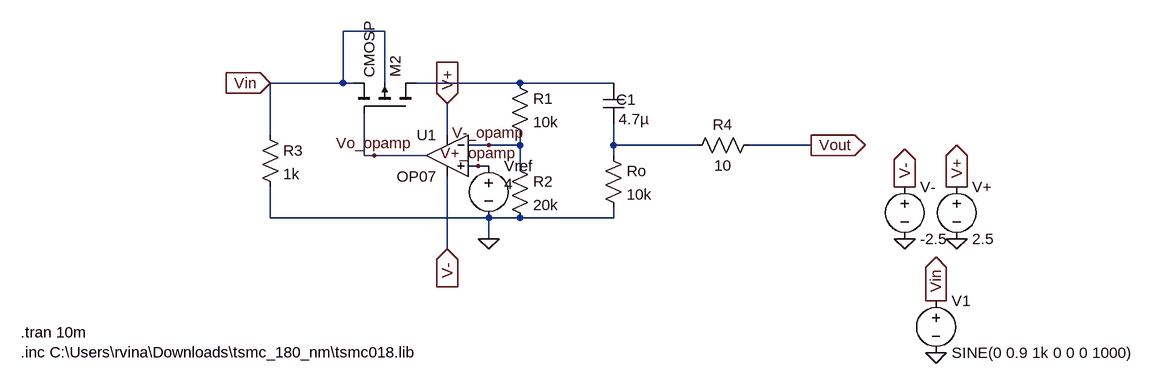
[diagram p0: schematic LDO.asc]
LDO.asc, the LTspice schematic file:
Version 4
SHEET 1 1232 680
WIRE 80 -16 16 -16
WIRE 16 64 16 -16
WIRE 16 64 -96 64
WIRE 32 64 16 64
WIRE 80 64 80 -16
WIRE 288 64 128 64
WIRE 432 64 288 64
WIRE -96 144 -96 64
WIRE 176 144 176 96
WIRE 240 160 208 160
WIRE 288 160 288 144
WIRE 288 160 240 160
WIRE 432 160 432 128
WIRE 560 160 432 160
WIRE 736 160 640 160
WIRE 48 176 48 112
WIRE 64 176 48 176
WIRE 144 176 64 176
WIRE 432 176 432 160
WIRE 224 192 208 192
WIRE 240 192 224 192
WIRE 288 192 288 160
WIRE -96 272 -96 224
WIRE 240 272 -96 272
WIRE 288 272 240 272
WIRE 432 272 432 256
WIRE 432 272 288 272
WIRE 240 304 240 272
WIRE 176 320 176 208
FLAG 240 304 0
FLAG 736 160 Vout
IOPIN 736 160 Out
FLAG 176 96 V+
IOPIN 176 96 In
FLAG 176 320 V-
IOPIN 176 320 In
FLAG 880 304 0
FLAG 960 304 0
FLAG 880 224 V-
IOPIN 880 224 Out
FLAG 960 224 V+
IOPIN 960 224 Out
FLAG 928 480 0
FLAG 928 400 Vin
IOPIN 928 400 Out
FLAG -96 64 Vin
IOPIN -96 64 In
FLAG 240 160 V-_opamp
FLAG 224 192 V+_opamp
FLAG 64 176 Vo_opamp
SYMBOL res 272 48 R0
SYMATTR InstName R1
SYMATTR Value 10k
SYMBOL res 272 176 R0
SYMATTR InstName R2
SYMATTR Value 20k
SYMBOL voltage 240 176 R0
WINDOW 123 0 0 Left 0
WINDOW 39 0 0 Left 0
WINDOW 3 24 44 Left 2
SYMATTR Value 4
SYMATTR InstName Vref
SYMBOL voltage 928 384 R0
WINDOW 123 0 0 Left 0
WINDOW 39 0 0 Left 0
SYMATTR InstName V1
SYMATTR Value SINE(0 0.9 1k 0 0 0 1000)
SYMBOL res 416 160 R0
SYMATTR InstName Ro
SYMATTR Value 10k
SYMBOL Opamps\\OP07 176 112 M0
SYMATTR InstName U1
SYMBOL voltage 960 208 R0
WINDOW 123 0 0 Left 0
WINDOW 39 0 0 Left 0
SYMATTR InstName V+
SYMATTR Value 2.5
SYMBOL voltage 880 208 R0
WINDOW 123 0 0 Left 0
WINDOW 39 0 0 Left 0
SYMATTR InstName V-
SYMATTR Value -2.5
SYMBOL cap 416 64 R0
WINDOW 0 20 26 Left 2
SYMATTR InstName C1
SYMATTR Value 4.7µ
SYMBOL cmosp 128 112 M270
SYMATTR InstName M2
SYMBOL res -112 128 R0
SYMATTR InstName R3
SYMATTR Value 1k
SYMBOL res 656 144 R90
WINDOW 0 0 56 VBottom 2
WINDOW 3 32 56 VTop 2
SYMATTR InstName R4
SYMATTR Value 10
TEXT -480 448 Left 2 !.tran 10m\n.inc C:\\Users\\rvina\\Downloads\\tsmc_180_nm\\tsmc018.lib

The netlist it stands for:
* LDO.asc
R1 N001 V-_opamp 10k
R2 V-_opamp 0 20k
Vref V+_opamp 0 4
V1 Vin 0 SINE(0 0.9 1k 0 0 0 1000)
Ro N002 0 10k
XU1 V+_opamp V-_opamp V+ V- Vo_opamp LT1001  ; OP07, pins In+ In- V+ V- OUT
V+ V+ 0 2.5
V- V- 0 -2.5
C1 N001 N002 4.7µ
M2 N001 Vo_opamp Vin Vin CMOSP
R3 Vin 0 1k
R4 Vout N002 10
.model NMOS NMOS
.model PMOS PMOS
.lib standard.mos
.tran 10m
.inc C:\Users\rvina\Downloads\tsmc_180_nm\tsmc018.lib
.lib LTC.lib
.backanno
.end